# EAGLE design Treo2 (EAGLE 6.5.0)
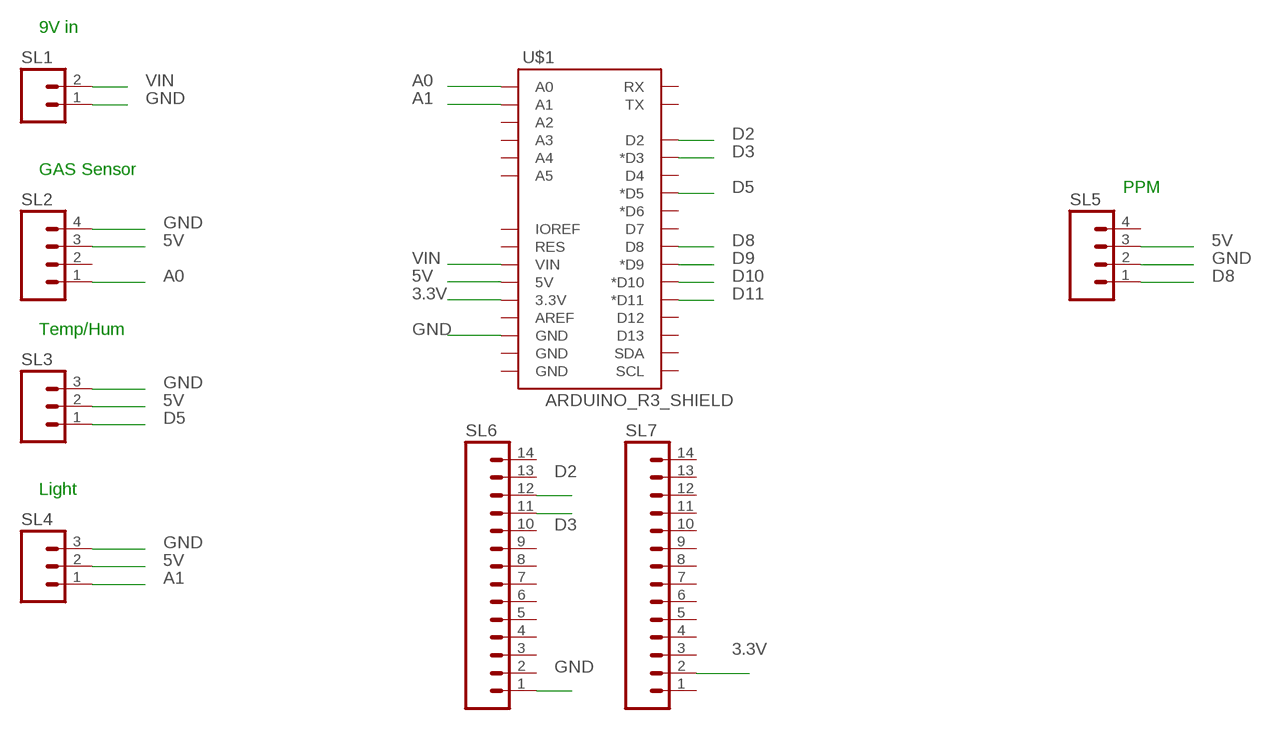
[diagram p0: schematic, sheet 1]

## Parts
SL1  M02  [02P]
SL2  M04  [04P]
SL3  M03  [03P]
SL4  M03  [03P]
SL5  M04  [04P]
SL6  M14  [14P]
SL7  M14  [14P]
U$1  ARDUINO_R3_SHIELD  [UNO_R3_SHIELD]

## Nets
3.3V: SL7.2 U$1.3.3V
5V: SL2.3 SL3.2 SL4.2 SL5.3 U$1.5V
A0: SL2.1 U$1.A0
A1: SL4.1 U$1.A1
D2: SL6.12 U$1.D2
D3: SL6.11 U$1.D3(*D3)
D5: SL3.1 U$1.D5(*D5)
D8: SL5.1 U$1.D8
D9: U$1.D9(*D9)
D10: U$1.D10(*D10)
D11: U$1.D11(*D11)
GND: SL1.1 SL2.4 SL3.3 SL4.3 SL5.2 SL6.1 U$1.GND@2(GND)
VIN: SL1.2 U$1.VIN
Unconnected: SL2.2 SL5.4 SL6.2 SL6.3 SL6.4 SL6.5 SL6.6 SL6.7 SL6.8 SL6.9 SL6.10 SL6.13 SL6.14 SL7.1 SL7.3 SL7.4 SL7.5 SL7.6 SL7.7 SL7.8 SL7.9 SL7.10 SL7.11 SL7.12 SL7.13 SL7.14 U$1.A2 U$1.A3 U$1.A4 U$1.A5 U$1.AREF U$1.D4 U$1.D6(*D6) U$1.D7 U$1.D12 U$1.D13 U$1.GND@0(GND) U$1.GND@1(GND) U$1.IOREF U$1.RES U$1.RX U$1.SCL U$1.SDA U$1.TX

## Notes on the sheet
- 9V in
- GAS Sensor
- PPM
- Temp/Hum
- Light

## Library data of the parts
SL1 = con-amp-quick:M02: AMP QUICK CONNECTOR; OC_FARNELL: unknown; OC_NEWARK: unknown
SL2 SL5 = con-amp-quick:M04: AMP QUICK CONNECTOR; OC_FARNELL: unknown; OC_NEWARK: unknown
SL3 SL4 = con-amp-quick:M03: AMP QUICK CONNECTOR; OC_FARNELL: unknown; OC_NEWARK: unknown
SL6 SL7 = con-amp-quick:M14: AMP QUICK CONNECTOR; OC_FARNELL: unknown; OC_NEWARK: unknown
U$1 = SparkFun-Boards:ARDUINO_R3_SHIELD: Shield form compatible with the Arduino Uno R3.

## Board
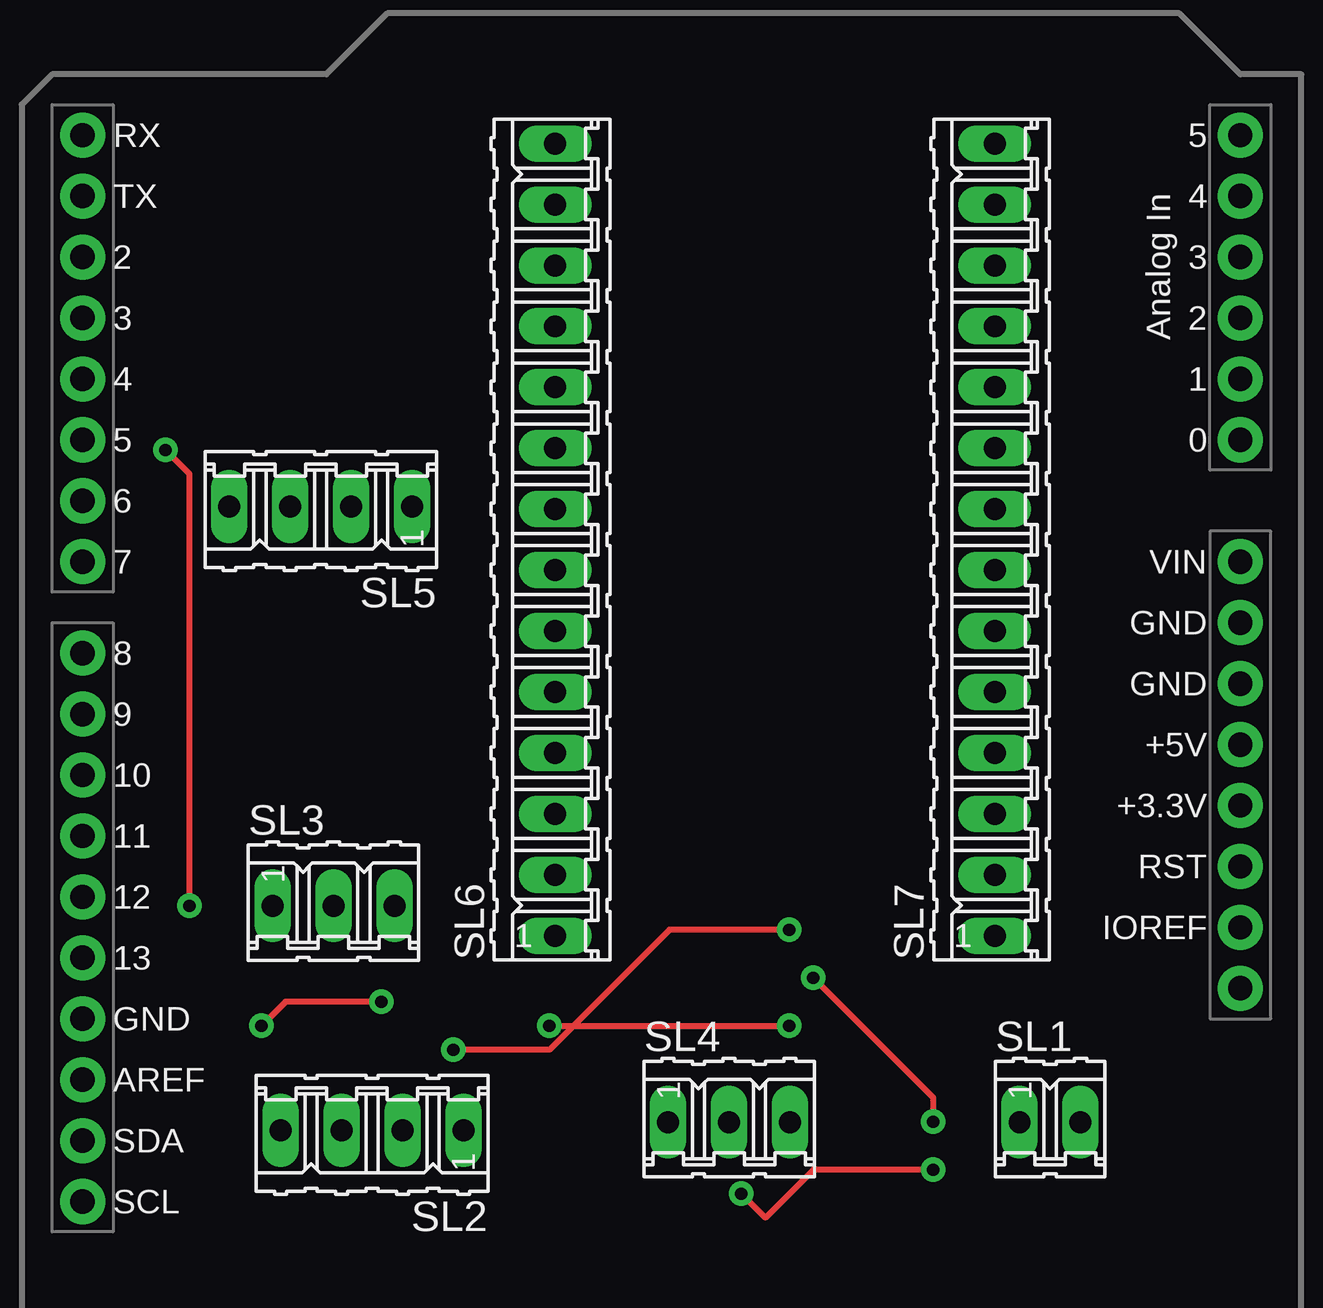
[diagram p1: board, top side]
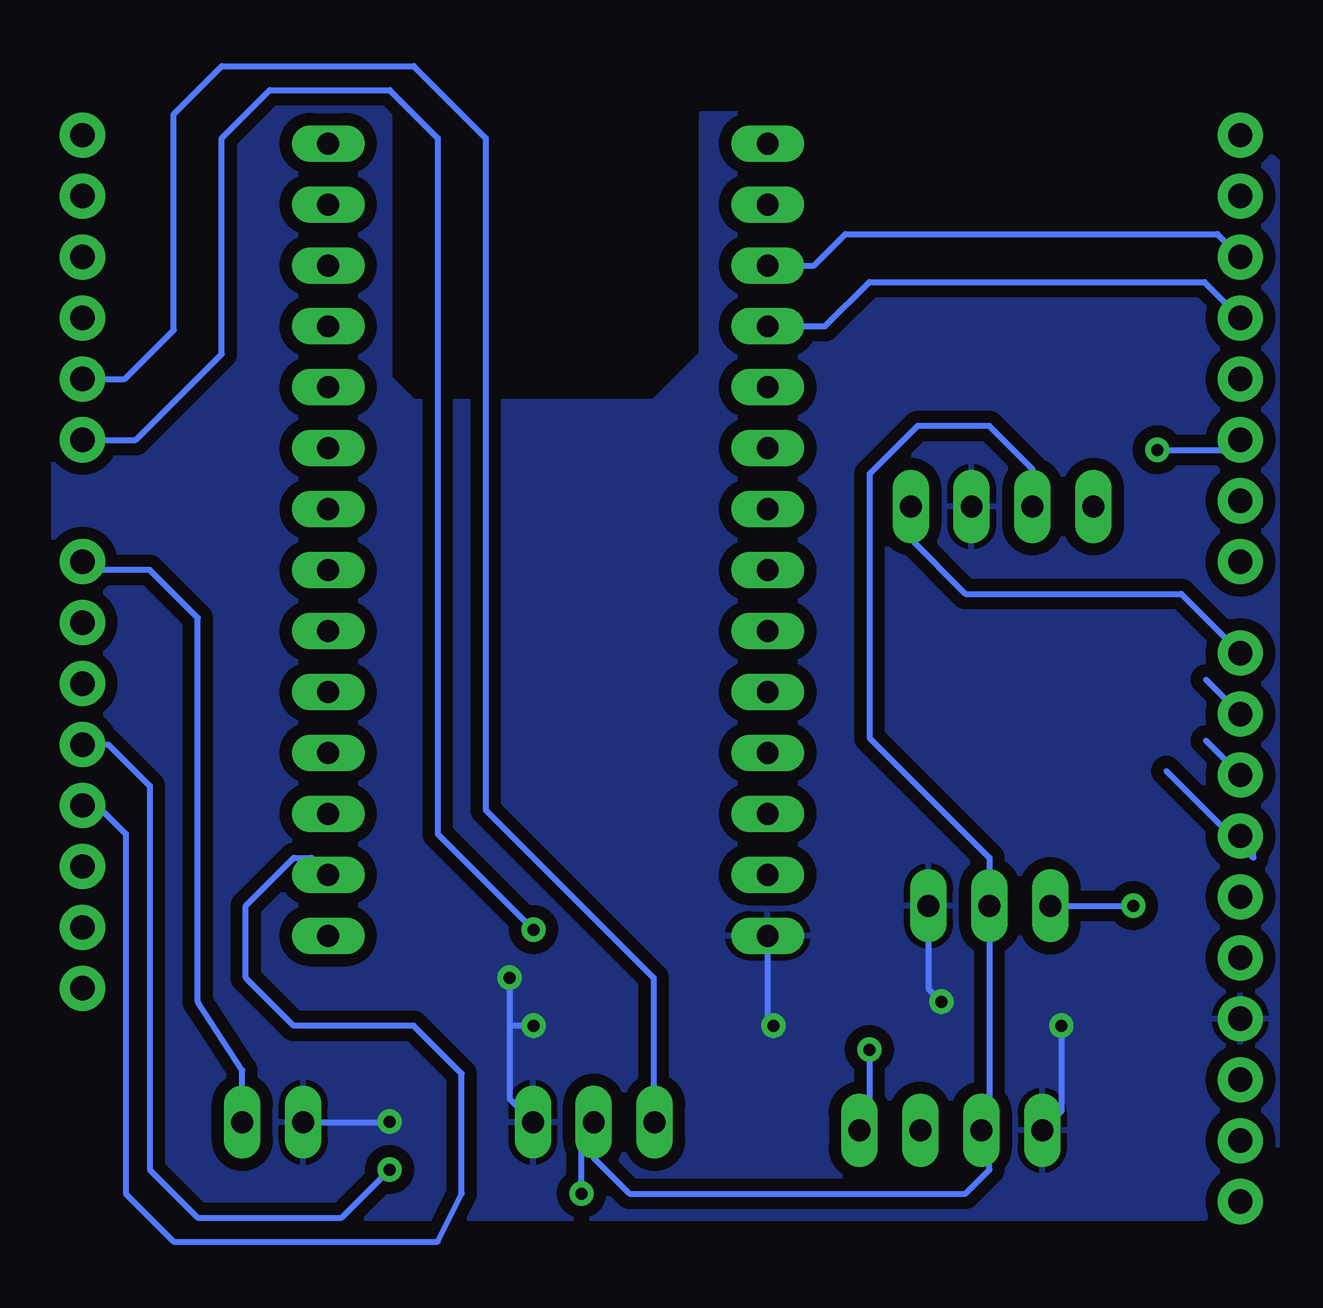
[diagram p2: board, bottom side, seen from below]

No outline drawn. Coordinates in mm, seen from the top.
Copper layers (1*16): Top 0.035mm / dielectric 1.5mm / Bottom 0.035mm
Design rules "SparkFun-Home": minimum track width 24mil, minimum drill 20mil, track to track 20mil, track to pad 20mil, pad to pad 20mil, via to via 20mil, smd to smd 8mil, copper to edge 10mil, drill to drill 8mil, minimum pad ring 12mil, minimum via ring 10mil, stop-mask expansion 4mil, vias tented up to drill 25mil, thermal gap 10mil

### Footprints (pad centres in the part's own frame; a part is rotated, then mirrored left to right if it is on the bottom)
02P = drill 0.914 long: 1 -1.27,0; 2 1.27,0
04P = drill 0.914 long: 1 -3.81,0; 2 -1.27,0; 3 1.27,0; 4 3.81,0
03P = drill 0.914 long: 1 -2.54,0; 2 0,0; 3 2.54,0
14P = drill 0.914 long: 1 -16.51,0; 2 -13.97,0; 3 -11.43,0; 4 -8.89,0; 5 -6.35,0; 6 -3.81,0; 7 -1.27,0; 8 1.27,0; 9 3.81,0; 10 6.35,0; 11 8.89,0; 12 11.43,0; 13 13.97,0; 14 16.51,0
UNO_R3_SHIELD = drill 1.016 pad 1.88: 3.3V 50.8,26.67; 5V 50.8,29.21; A0 50.8,41.91; A1 50.8,44.45; A2 50.8,46.99; A3 50.8,49.53; A4 50.8,52.07; A5 50.8,54.61; AREF 2.54,15.24; D2 2.54,49.53; D3 2.54,46.99; D4 2.54,44.45; D5 2.54,41.91; D6 2.54,39.37; D7 2.54,36.83; D8 2.54,33.02; D9 2.54,30.48; D10 2.54,27.94; D11 2.54,25.4; D12 2.54,22.86; D13 2.54,20.32; GND@0 50.8,31.75; GND@1 50.8,34.29; GND@2 2.54,17.78; IOREF 50.8,21.59; NC 50.8,19.05; RES 50.8,24.13; RX 2.54,54.61; SCL 2.54,10.16; SDA 2.54,12.7; TX 2.54,52.07; VIN 50.8,36.83

### Placement (x,y rotation side)
SL1  42.87,29.98 0 top
SL2  14.61,29.64 180 top
SL3  13,39 0 top
SL4  29.49,29.98 0 top
SL5  12.47,55.64 180 top
SL6  22.24,54.26 90 top
SL7  40.56,54.26 90 top
U$1  0,16.51 0 top

### Tracks (layer width: path | path; a pad name or v marks a point on that pad's centre or on a via)
3.3V
  Bottom 0.254: U$1.3.3V 50.18,43.18 49,42 49,27 47,25 36,25 35,27 35,32 37,34 42,34 44,36 44,39 42,41 41.27,41 SL7.2
5V  (via drill 0.51)
  Top 0.254: v38,28 33,28 31,26 v30,27
  Bottom 0.254: SL5.3 11.2,57.2 13,59 16,59 18,57 18,46 13,41 SL3.2 13,29.98 SL2.3 13,29.3 13,28 14,27 28,27 29.49,28.49 SL4.2 30,29.47 v30,27 | U$1.5V 49.72,45.72 48,44 48,28 46,26 40,26 v38,28
A0  (via drill 0.51)
  Top 0.254: v32,38 27,38 22,33 v18,33
  Bottom 0.254: U$1.A0 48.58,58.42 45,62 45,71 43,73 38,73 36,71 36,42 v32,38 | v18,33 18,30.06 SL2.1
A1
  Bottom 0.254: U$1.A1 49.04,60.96 47,63 47,72 45,74 37,74 34,71 34,43 27,36 27,30.03 SL4.1
D2
  Bottom 0.254: SL6.12 20.31,65.69 19,67 3.5,67 U$1.D2
D3
  Bottom 0.254: SL6.11 19.85,63.15 18,65 4.04,65 U$1.D3
D5  (via drill 0.51)
  Top 0.254: v7,39 7,57 v6,58
  Bottom 0.254: SL3.1 v7,39 | v6,58 2.96,58 U$1.D5
D8
  Bottom 0.254: SL5.1 16.28,54.28 14,52 5.01,52 U$1.D8
D9
  Bottom 0.254: 3.98,48.42 U$1.D9
D10
  Bottom 0.254: 3.98,45.88 U$1.D10
D11
  Bottom 0.254: 5.62,44.62 2,41 2,41.37 U$1.D11
GND  (via drill 0.51)
  Top 0.254: v15,35 11,35 v10,34 | v22,34 v32,34 | v38,30 38,31 v33,36
  Bottom 0.254: SL3.3 15.54,35.54 v15,35 | v10,34 10,30.44 SL2.4 | SL6.1 22.24,34.24 v22,34 | v32,34 33,34 | 33,34 33,30.95 SL4.3 | SL1.1 38.02,29.98 v38,30 | v33,36 33,34
  pour Bottom: 1,70 3,72 25,72 25,62 27,60 37,60 38,61 38,72 39,73 51,73 52,72 52,28 50,26 4,26 1,29
VIN
  Bottom 0.254: SL1.2 44.14,32.14 46,35 46,51 48,53 50.46,53 U$1.VIN